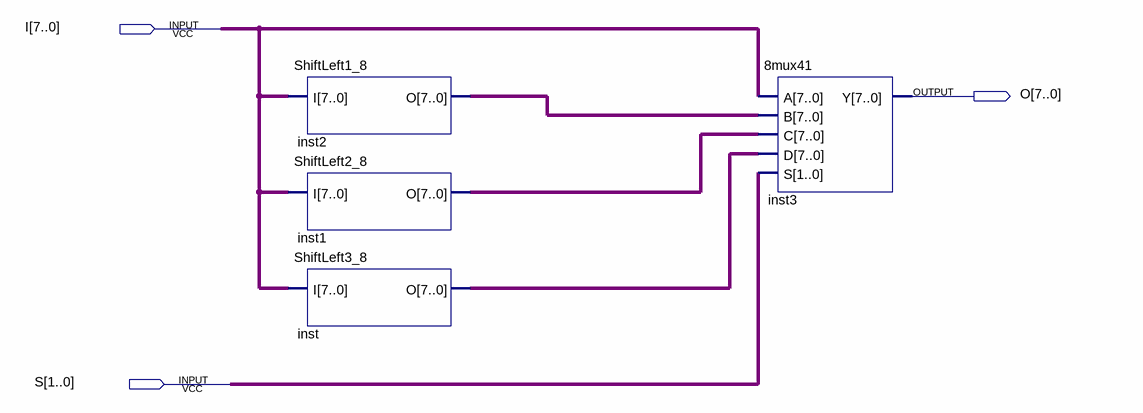
[diagram p0: schematic sheet]
// Quartus schematic ShiftLeft.bdf as structural Verilog: 4 symbols, 3 pins
module ShiftLeft (
  input  [7:0] I,
  input  [1:0] S,
  output [7:0] O
);

  wire [7:0] inst1_o, inst2_o, inst_o;

  ShiftLeft1_8 inst2 (.I(I), .O(inst2_o));
  ShiftLeft2_8 inst1 (.I(I), .O(inst1_o));
  ShiftLeft3_8 inst (.I(I), .O(inst_o));
  \8mux41  inst3 (.A(I), .B(inst2_o), .C(inst1_o), .D(inst_o), .S(S), .Y(O));
endmodule
